# EAGLE design Hauptsignal (EAGLE 8.2.2)
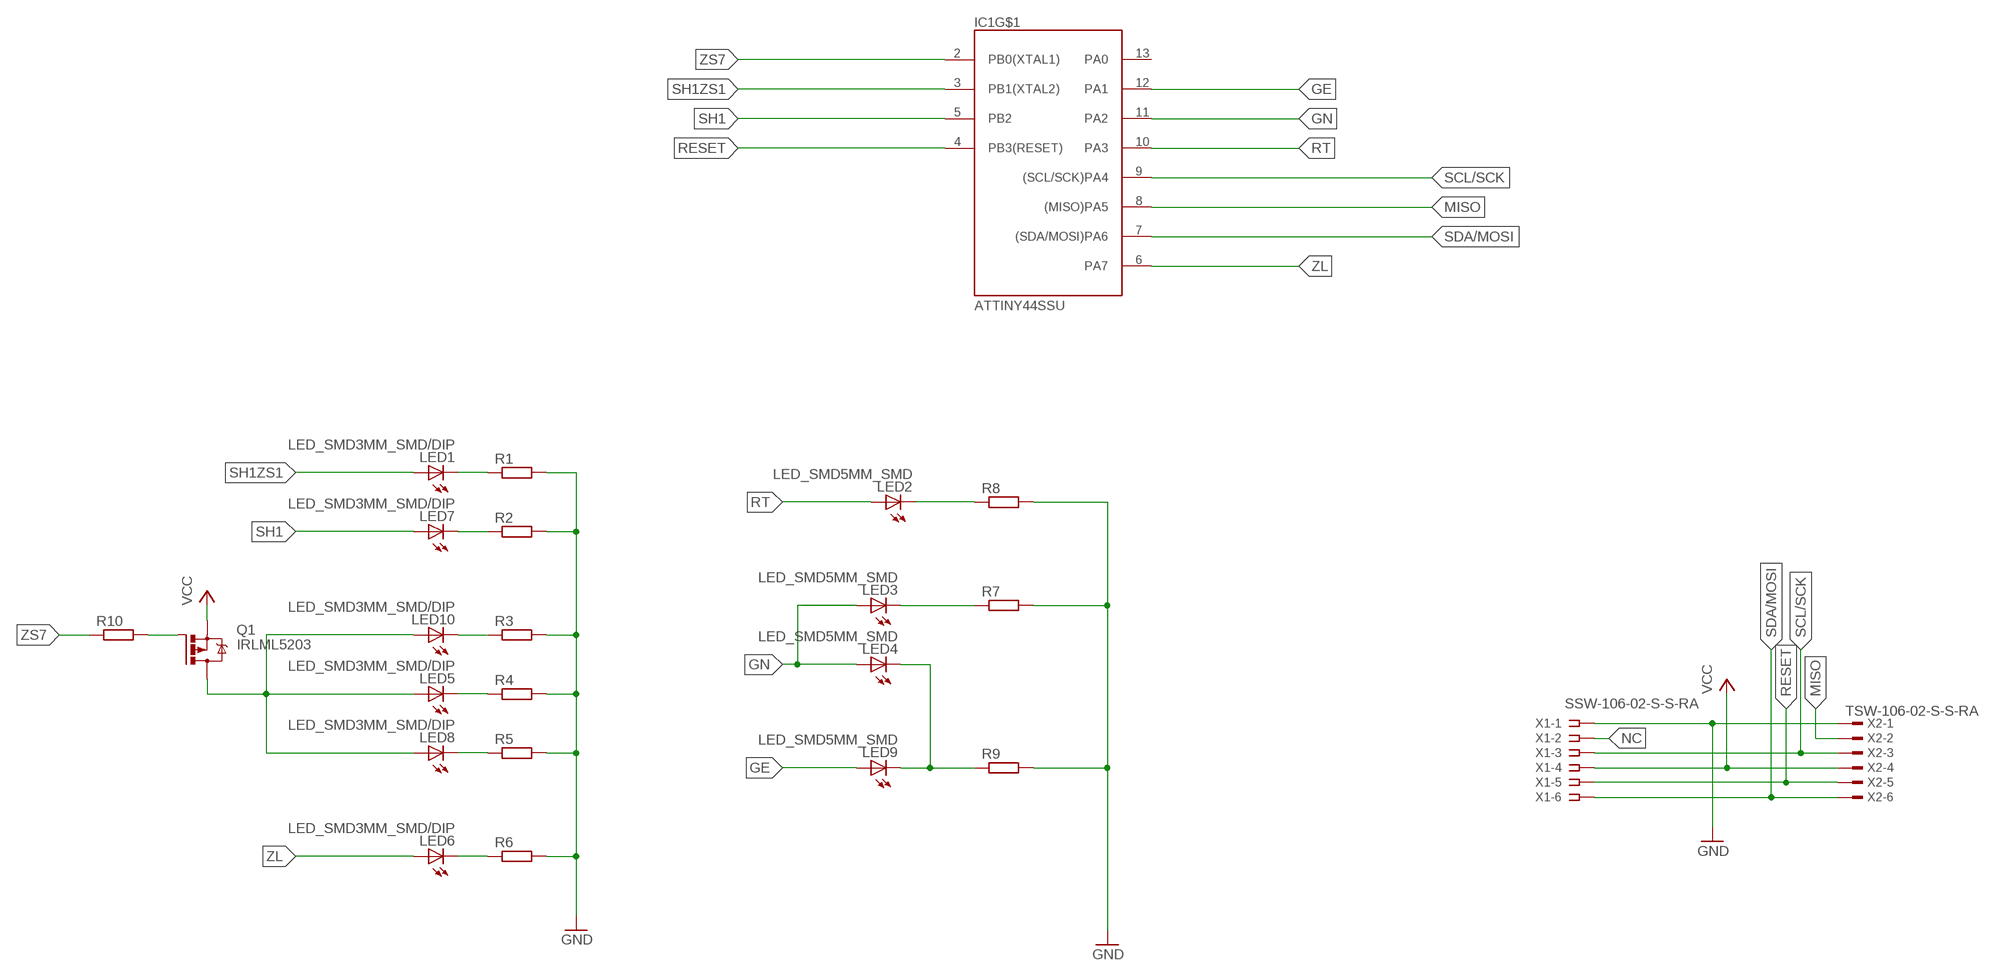
[diagram p0: schematic, sheet 1]

## Parts
IC1  ATTINY44SSU  [SO14]
LED1  LED_SMD3MM_SMD/DIP  [3MM_FLAT/DIP_SMDLED]
LED2  LED_SMD5MM_SMD  [5MM_FLAT_SMDLED]
LED3  LED_SMD5MM_SMD  [5MM_FLAT_SMDLED]
LED4  LED_SMD5MM_SMD  [5MM_FLAT_SMDLED]
LED5  LED_SMD3MM_SMD/DIP  [3MM_FLAT/DIP_SMDLED]
LED6  LED_SMD3MM_SMD/DIP  [3MM_FLAT/DIP_SMDLED]
LED7  LED_SMD3MM_SMD/DIP  [3MM_FLAT/DIP_SMDLED]
LED8  LED_SMD3MM_SMD/DIP  [3MM_FLAT/DIP_SMDLED]
LED9  LED_SMD5MM_SMD  [5MM_FLAT_SMDLED]
LED10  LED_SMD3MM_SMD/DIP  [3MM_FLAT/DIP_SMDLED]
Q1  IRLML5203  [MICRO3]
R1  R-EU_R0603  [R0603]
R2  R-EU_R0603  [R0603]
R3  R-EU_R0603  [R0603]
R4  R-EU_R0603  [R0603]
R5  R-EU_R0603  [R0603]
R6  R-EU_R0603  [R0603]
R7  R-EU_R0603  [R0603]
R8  R-EU_R0603  [R0603]
R9  R-EU_R0603  [R0603]
R10  R-EU_R0603  [R0603]
X1  SSW-106-02-S-S-RA  [SSW-106-02-S-S-RA]
X2  TSW-106-02-S-S-RA  [TSW-106-02-S-S-RA]

## Nets
GE: IC1.12(PA1) LED9.+(A)
GN: IC1.11(PA2) LED3.+(A) LED4.+(A)
GND: R1.2 R2.2 R3.2 R4.2 R5.2 R6.2 R7.2 R8.2 R9.2 X1.1 X2.1
MISO: IC1.8((MISO)PA5) X2.2
N$1: LED4.-(C) LED9.-(C) R9.1
N$2: LED6.-(C) R6.1
N$3: LED8.-(C) R5.1
N$4: LED5.-(C) R4.1
N$5: LED10.-(C) R3.1
N$6: LED7.-(C) R2.1
N$7: LED1.-(C) R1.1
N$8: LED3.-(C) R7.1
N$9: LED2.-(C) R8.1
N$10: LED5.+(A) LED8.+(A) LED10.+(A) Q1.3(D)
N$11: Q1.1(G) R10.2
NC: X1.2
RESET: IC1.4(PB3(RESET)) X1.5 X2.5
RT: IC1.10(PA3) LED2.+(A)
SCL/SCK: IC1.9((SCL/SCK)PA4) X1.3 X2.3
SDA/MOSI: IC1.7((SDA/MOSI)PA6) X1.6 X2.6
SH1: IC1.5(PB2) LED7.+(A)
SH1ZS1: IC1.3(PB1(XTAL2)) LED1.+(A)
VCC: Q1.2(S) X1.4 X2.4
ZL: IC1.6(PA7) LED6.+(A)
ZS7: IC1.2(PB0(XTAL1)) R10.1
Unconnected: IC1.13(PA0)

## Power pins joined to a net without a drawn wire
GND: IC1.14(GND)
VCC: IC1.1(VCC)

## Library data of the parts
IC1 = Attiny:ATTINY44: ATtiny24A/44A/84A are low-power CMOS 8-bit microcontrollers based on the AVR enhanced RISC architecture. By executing powerful in structions in a single clock cycle, the ATtiny24A/44A/84A achieves throughputs approaching 1 MIPS per MHz allowing the system designer to optimize power consum ption versus processing speed.
LED1-LED10 = LEDFLATTOP:LED_SMD: SMD LED 3/5mm für flat surface mount.
Q1 = transistor-power:IRLML5203: HEXFET P-Channel Power MOSFET
R1-R10 = rcl:R-EU_: RESISTOR, European symbol
X1 = con-samtec:SSW-106-02-S-S: THROUGH-HOLE .025" SQ POST SOCKET Source: Samtec SSW.pdf; MPN: SSW-106-02-S-S-RA; OC_FARNELL: unknown; OC_NEWARK: 11P9417
X2 = con-samtec:TSW-106-02-S-S: THROUGH-HOLE .025" SQ POST HEADER Source: Samtec TSW.pdf; OC_FARNELL: unknown; OC_NEWARK: unknown

## Board
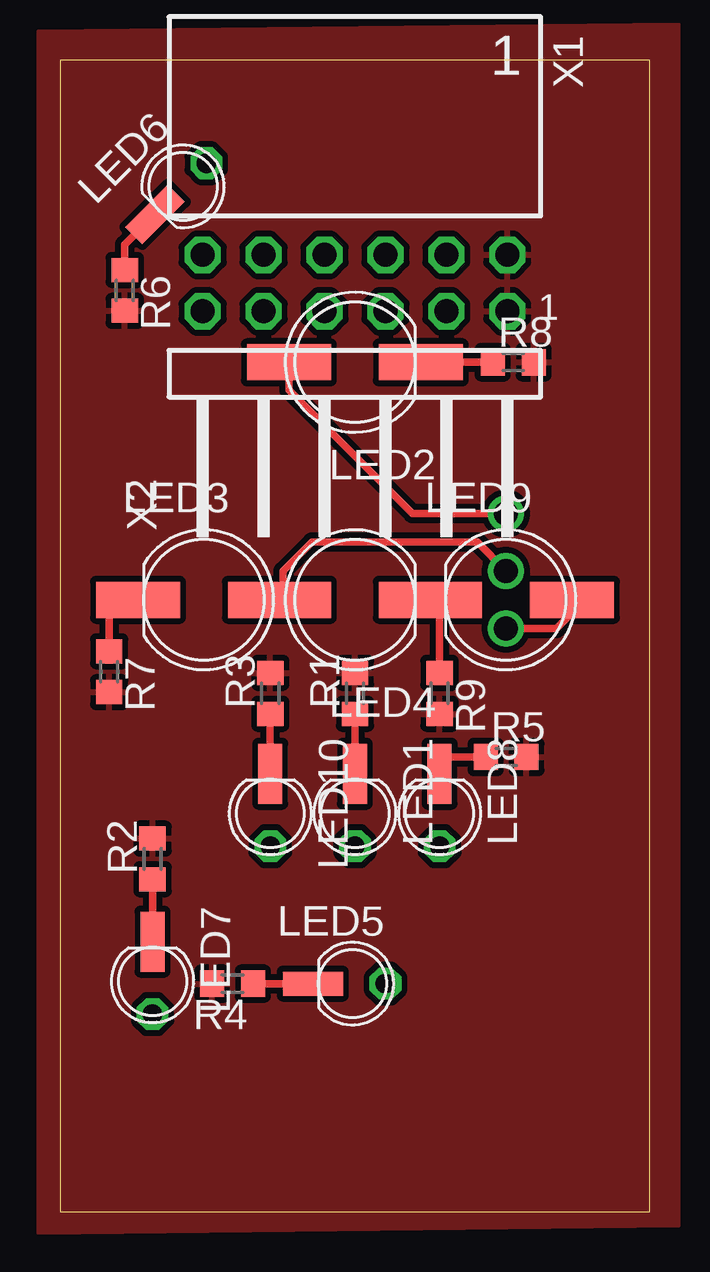
[diagram p1: board, top side]
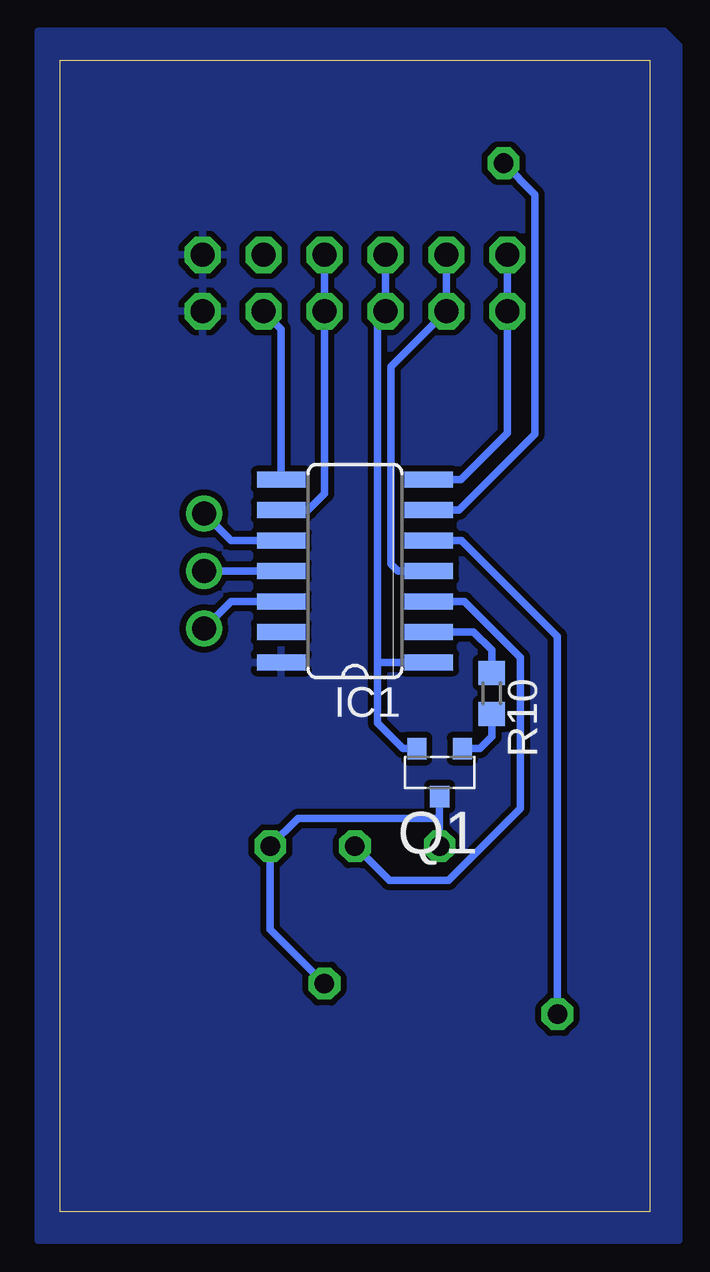
[diagram p2: board, bottom side, seen from below]

Size 24.6 x 48 mm. Coordinates in mm from the lower left corner, seen from the top.
Outline: 0,0 24.6,0 24.6,48 0,48 0,0
Copper layers (1*16): Top 0.035mm / dielectric 1.5mm / Bottom 0.035mm
Design rules "default *": minimum track width 6mil, minimum drill 0.35mm, track to track 10mil, track to pad 10mil, pad to pad 10mil, via to via 10mil, smd to smd 10mil, copper to edge 0mil, drill to drill 6mil, minimum pad ring 10mil, minimum via ring 8mil, stop-mask expansion 4mil, vias tented up to drill 0mil, thermal gap 10mil

### Footprints (pad centres in the part's own frame; a part is rotated, then mirrored left to right if it is on the bottom)
SO14 = smd 0.66 x 2.032: 1 -3.81,-3.073; 2 -2.54,-3.073; 3 -1.27,-3.073; 4 0,-3.073; 5 1.27,-3.073; 6 2.54,-3.073; 7 3.81,-3.073; 8 3.81,3.073; 9 2.54,3.073; 10 1.27,3.073; 11 0,3.073; 12 -1.27,3.073; 13 -2.54,3.073; 14 -3.81,3.073
3MM_FLAT/DIP_SMDLED = drill 0.813 octagon: + 1.27,0 | smd 2.5 x 1: - -1.75,0
5MM_FLAT_SMDLED = smd 3.5 x 1.5: + 2.75,0; - -2.75,0
MICRO3 = smd 0.8 x 0.9: 1 -0.95,-1; 2 0.95,-1; 3 0,1
R0603 = smd 1 x 1.1: 1 -0.85,0; 2 0.85,0
SSW-106-02-S-S-RA = drill 1 pad 1.5 octagon: 1 -6.35,1.524; 2 -3.81,1.524; 3 -1.27,1.524; 4 1.27,1.524; 5 3.81,1.524; 6 6.35,1.524
TSW-106-02-S-S-RA = drill 1 pad 1.5 octagon: 1 6.35,1.524; 2 3.81,1.524; 3 1.27,1.524; 4 -1.27,1.524; 5 -3.81,1.524; 6 -6.35,1.524

### Placement (x,y rotation side)
IC1  12.3,26.7 90 bottom
LED1  12.3,16.5 270 top
LED2  12.3,35.4 180 top
LED3  6,25.5 0 top
LED4  12.3,25.5 180 top
LED5  12.3,9.5 0 top
LED6  5.2,42.8 45 top
LED7  3.86,9.5 270 top
LED8  15.83,16.5 270 top
LED9  18.6,25.5 0 top
LED10  8.77,16.5 270 top
Q1  8.77,18.3 180 bottom
R1  12.3,21.6 90 top
R2  3.86,14.7 90 top
R3  8.77,21.6 90 top
R4  7.2,9.5 180 top
R5  18.6,18.95 0 top
R6  2.7,38.4 270 top
R7  2.05,22.5 270 top
R8  18.9,35.4 0 top
R9  15.83,21.6 270 top
R10  6.6,21.6 270 bottom
X1  12.3,41.4 180 top
X2  12.3,36 0 top

### Tracks (layer width: path | path; a pad name or v marks a point on that pad's centre or on a via)
GE  (via drill 1)
  Top 0.305: v18.6,24.3 20.7,24.3 21.3,24.9 21.3,25.45 LED9.+
  Bottom 0.305: IC1.12 17.47,25.43 v18.6,24.3
GN  (via drill 1)
  Top 0.305: 9.3,25.5 LED3.+ | 9.3,25.5 LED4.+ 9.3,25.5 | 9.3,25.5 | v18.6,26.7 17.4,27.9 10.5,27.9 9.3,26.7 9.3,25.5
  Bottom 0.305: IC1.11 v18.6,26.7
GND
  pour Top: -0.9,49.2 25.8,49.5 25.8,-0.6 -0.9,-0.9
  pour Bottom: -1.2,48.6 -1.2,-1.2 25.5,-1.2 25.5,49.2 -0.6,49.2
MISO
  Bottom 0.305: X2.2 15.37,36.79 IC1.8
N$1
  Top 0.305: R9.1 15.83,25.5 LED9.- LED4.-
N$2
  Top 0.305: R6.1 2.7,40.3 LED6.-
N$3
  Top 0.305: LED8.- 15.83,18.95 R5.1
N$4
  Top 0.305: R4.1 LED5.-
N$5
  Top 0.305: R3.1 LED10.-
N$6
  Top 0.305: R2.1 LED7.-
N$7
  Top 0.305: LED1.- R1.1
N$8
  Top 0.305: R7.1 2.05,25.5 LED3.-
N$9
  Top 0.305: R8.1 LED2.-
N$10
  Bottom 0.305: 8.77,16.39 Q1.3 | 8.77,16.39 LED10.+ | 8.77,16.39 14.67,16.39 LED8.+ 15.83,11.76 LED5.+
N$11
  Bottom 0.305: R10.2 6.6,19.8 7.1,19.3 Q1.1
RESET
  Bottom 0.305: X1.5 X2.5 10.8,35.21 10.8,27 10.5,26.7 IC1.4
RT  (via drill 1)
  Top 0.305: LED2.+ 9.55,34.25 14.7,29.1 v18.6,29.1
  Bottom 0.305: 15.44,27.9 IC1.10 17.47,27.97 v18.6,29.1
SCL/SCK
  Bottom 0.305: X1.3 X2.3 13.57,29.93 14.26,29.24 IC1.9
SDA/MOSI
  Bottom 0.305: X1.6 X2.6 5.95,32.45 7.89,30.51 IC1.7
SH1
  Bottom 0.305: IC1.5 7.87,27.97 3.86,23.96 LED7.+
SH1ZS1
  Bottom 0.305: 9.16,25.5 IC1.3 7.73,25.43 5.4,23.1 5.4,16.8 8.4,13.8 10.87,13.8 LED1.+
VCC
  Bottom 0.305: X1.4 X2.4 11.36,37.2 11.36,22.87 | 11.36,22.87 11.36,20.36 10.3,19.3 Q1.2 | IC1.1 11.36,22.89 11.36,22.87
ZL
  Bottom 0.305: 4.79,37.04 4.8,37.03 | LED6.+ 4.79,42.39 4.79,37.04 | IC1.6 7.96,29.24 4.79,32.41 4.79,37.04
ZS7
  Bottom 0.305: IC1.2 7.36,24.16 6.6,23.4 R10.1